# EAGLE design Board AWS_ESP32_v6 (EAGLE 9.5.2)
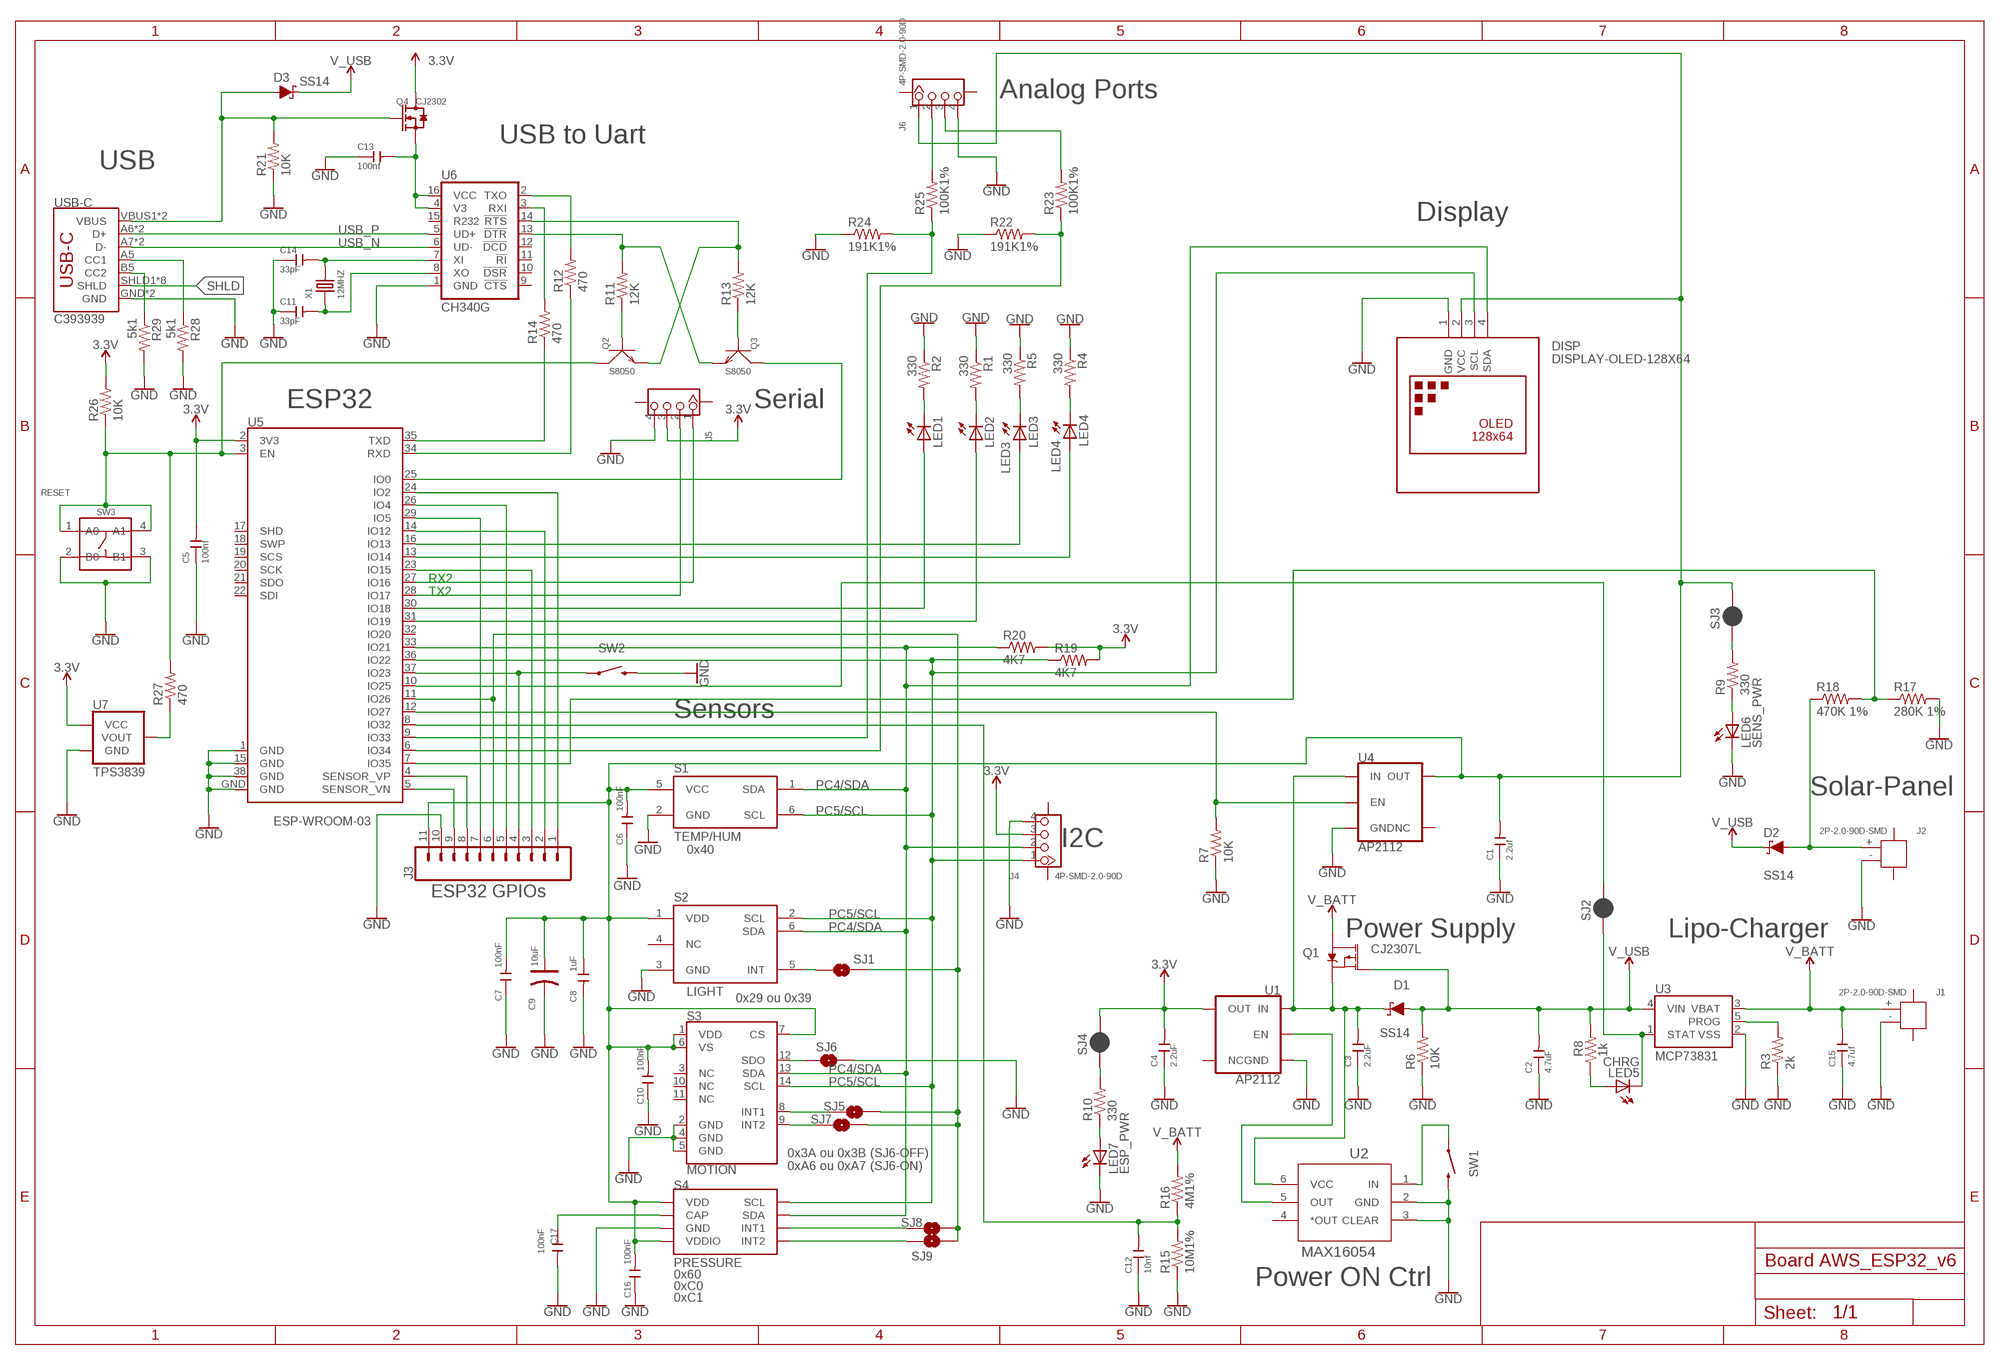
[diagram p0: schematic, sheet 1]

## Parts
C1  2.2uf  CERAMIC-2.2UF-10V-10%-X7R(0603)  [C0603]
C2  4.7uF  CERAMIC-4.7UF-10V-10%-X5R(0603)  [C0603]
C3  2.2uF  CERAMIC-2.2UF-10V-10%-X7R(0603)  [C0603]
C4  2.2uF  CERAMIC-2.2UF-10V-10%-X7R(0603)  [C0603]
C5  100nf  CERAMIC-100NF-50V-10%-X7R(0603)  [C0603]
C6  100nF  C-0603  [C0603]
C7  100nF  C-0603  [C0603]
C8  1uF  C-0805  [C0805]
C9  10uF  CAP-AVX-A  [AVX-A]
C10  100nF  C-0603  [C0603]
C11  33pF  CERAMIC-10PF-50V-5%-NPO(0603)  [C0603]
C12  10nf  CERAMIC-100NF-50V-10%-X7R(0603)  [C0603]
C13  100nf  CERAMIC-100NF-50V-10%-X7R(0603)  [C0603]
C14  33pF  CERAMIC-10PF-50V-5%-NPO(0603)  [C0603]
C15  4.7uf  CERAMIC-4.7UF-10V-10%-X5R(0603)  [C0603]
C16  100nF  C-0603  [C0603]
C17  100nF  C-0603  [C0603]
D1  SS14  DIODE-SCHOTTKY-SS14  [SMA-DIODE]
D2  SS14  DIODE-SCHOTTKY-SS14  [SMA-DIODE]
D3  SS14  DIODE-SCHOTTKY-SS14  [SMA-DIODE]
DISP  DISPLAY-OLED-128X64  DISPLAY-OLED-128X64-I2C  [DISPLAY-OLED-128X64-I2C]
J1  2P-2.0-90D-SMD  CONN-HEADER-SMD-PH-SIDE-(2P-2.0MM)  [HW2-SMD-2.0-90D]
J2  2P-2.0-90D-SMD  CONN-HEADER-SMD-PH-SIDE-(2P-2.0MM)  [HW2-SMD-2.0-90D]
J3  CONN_11  [1X11]
J4  4P-SMD-2.0-90D  GROVE-CONNECTOR-SMD-90D(4+2P-2.0)  [HW4-SMD-2.0-90D]
J5  4P-SMD-2.0-90D  GROVE-CONNECTOR-SMD-90D(4+2P-2.0)  [HW4-SMD-2.0-90D]
J6  4P-SMD-2.0-90D  GROVE-CONNECTOR-SMD-90D(4+2P-2.0)  [HW4-SMD-2.0-90D]
LED1  LED1  LED0603  [LED-0603]
LED2  LED2  LED0603  [LED-0603]
LED3  LED3  LED0603  [LED-0603]
LED4  LED4  LED0603  [LED-0603]
LED5  CHRG  LED0603  [LED-0603]
LED6  SENS_PWR  LED0603  [LED-0603]
LED7  ESP_PWR  LED0603  [LED-0603]
Q1  CJ2307L  MOSFET_PCH-DMG2307L  [SOT23-3]
Q2  S8050  SMD-TRANSISTORS-NPN-25V-500MW-S8050(SOT-23)  [SOT-23]
Q3  S8050  SMD-TRANSISTORS-NPN-25V-500MW-S8050(SOT-23)  [SOT-23]
Q4  CJ2302  SMD-MOSFET-N-CH-20V-2.1A-CJ2302(SOT-23)  [SOT-23]
R1  330  RESISTOR0805-RES  [0805]
R2  330  RESISTOR0805-RES  [0805]
R3  2k  RESISTOR0805-RES  [0805]
R4  330  RESISTOR0805-RES  [0805]
R5  330  RESISTOR0805-RES  [0805]
R6  10K  RESISTOR0805-RES  [0805]
R7  10K  RESISTOR0805-RES  [0805]
R8  1k  RESISTOR0805-RES  [0805]
R9  330  RESISTOR0805-RES  [0805]
R10  330  RESISTOR0805-RES  [0805]
R11  12K  RESISTOR0805-RES  [0805]
R12  470  RESISTOR0805-RES  [0805]
R13  12K  RESISTOR0805-RES  [0805]
R14  470  RESISTOR0805-RES  [0805]
R15  10M1%  RESISTOR0805-RES  [0805]
R16  4M1%  RESISTOR0805-RES  [0805]
R17  280K 1%  RESISTOR0805-RES  [0805]
R18  470K 1%  RESISTOR0805-RES  [0805]
R19  4K7  RESISTOR0805-RES  [0805]
R20  4K7  RESISTOR0805-RES  [0805]
R21  10K  RESISTOR0805-RES  [0805]
R22  191K1%  RESISTOR0805-RES  [0805]
R23  100K1%  RESISTOR0805-RES  [0805]
R24  191K1%  RESISTOR0805-RES  [0805]
R25  100K1%  RESISTOR0805-RES  [0805]
R26  10K  RESISTOR0805-RES  [0805]
R27  470  RESISTOR0805-RES  [0805]
R28  5k1  RESISTOR0805-RES  [0805]
R29  5k1  RESISTOR0805-RES  [0805]
S1  TEMP/HUM  HDC1080  [WSON6]
S2  LIGHT  TSL2571FN  [FN-6]
S3  MOTION  ADXL345  [LGA-14]
S4  PRESSURE  MPL3115A2LGA8  [LGA8]
SJ1  IRQ_LIGHT  SOLDERJUMPERNO  [SJ_2S-NO]
SJ2  JUMPER-SMT_2_NC_PASTE_SILK  [SMT-JUMPER_2_NC_PASTE_SILK]
SJ3  JUMPER-SMT_2_NC_PASTE_SILK  [SMT-JUMPER_2_NC_PASTE_SILK]
SJ4  JUMPER-SMT_2_NC_PASTE_SILK  [SMT-JUMPER_2_NC_PASTE_SILK]
SJ5  INT1  SOLDERJUMPERNO  [SJ_2S-NO]
SJ6  ADXL_ADDRESS  SOLDERJUMPERNO  [SJ_2S-NO]
SJ7  INT1  SOLDERJUMPERNO  [SJ_2S-NO]
SJ8  INT1  SOLDERJUMPERNO  [SJ_2S-NO]
SJ9  INT2  SOLDERJUMPERNO  [SJ_2S-NO]
SW1  MOMENTARY-SWITCH-SPST-SMD-6.0X3.5MM  [TACTILE_SWITCH_SMD_6.0X3.5MM]
SW2  MOMENTARY-SWITCH-SPST-SMD-6.0X3.5MM  [TACTILE_SWITCH_SMD_6.0X3.5MM]
SW3  RESET  SMD-SWITCH-TACTILE-SPST-NO(4P-D6.0MM)  [SW4-SMD-6.0X6.0X5.0MM]
U1  AP2112  V_REG_AP2112K-3.3V  [SOT23-5]
U2  MAX16054  [SOT23-6]
U3  MCP73831  [SOT23-5]
U4  AP2112  V_REG_AP2112K-3.3V  [SOT23-5]
U5  ESP-WROOM-03  [ESP-WROOM-03]
U6  CH340G  CH340GSMD  [SO016]
U7  TPS3839  V_SUPERVISOR  [SOT23-3]
USB-C  C393939  SPARKFUN-CONNECTORS_USB_C16PIN  [SPARKFUN-CONNECTORS_USB-C-16P]
X1  12MHZ  SMD-CRYSTAL-12MHZ-20PF-20PPM-40R(2P-5.0X3.2MM)  [X2-SMD-5.0X3.2X1.3MM]

## Nets
3.3V [power]: C4.2 C5.2 J4.3 J5.3 Q4.3(D) R19.2 R20.2 R26.2 SJ4.2 U1.5(OUT) U5.2(3V3) U7.3(VCC)
BEE_RESET: Q2.3(C) R26.1 R27.2 SW3.1(A0) SW3.4(A1) U5.3(EN)
GND [power]: C1.1 C2.1 C3.1 C4.1 C5.1 C6.1 C7.1 C8.2 C9.- C10.1 C11.1 C12.1 C13.1 C14.1 C15.1 C16.1 C17.2 DISP.1(GND) J1.- J2.- J3.10 J4.4 J5.4 J6.4 LED6.C LED7.C R1.1 R2.1 R3.1 R4.1 R5.1 R6.1 R7.1 R15.1 R17.2 R21.1 R22.1 R24.1 R28.2 R29.2 S1.2(GND) S2.3(GND) S3.2(GND) S3.4(GND) S3.5(GND) S4.3(GND) SJ6.2 SW1.2 SW2.2 SW3.2(B0) SW3.3(B1) U1.2(GND) U2.2(GND) U2.3(CLEAR) U3.2(VSS) U4.2(GND) U5.1(GND) U5.15(GND) U5.38(GND) U5.GND U6.1(GND) U7.1(GND) USB-C.GND USB-C.GND2(GND)
N$1 [power]: C1.2 C6.2 C7.2 C8.1 C9.+ C10.2 C16.2 DISP.2(VCC) J3.11 J6.1 S1.5(VCC) S2.1(VDD) S3.1(VDD) S3.6(VS) S3.7(CS) S4.1(VDD) S4.4(VDDIO) SJ3.2 U4.5(OUT)
N$2: LED3.A U5.16(IO13)
N$3 [power]: D2.A J2.+ R18.1
N$4: R27.1 U7.2(VOUT)
N$5: LED1.A U5.30(IO18)
N$6: J3.5 U5.26(IO4)
N$7: C17.1 S4.2(CAP)
N$8: S3.8(INT1) SJ5.1
N$9: S3.9(INT2) SJ7.1
N$10 [power]: C13.2 Q4.2(S) U6.4(V3) U6.16(VCC)
N$11: LED2.A U5.31(IO19)
N$12: C12.2 R15.2 R16.1 U5.8(IO32)
N$13: J3.4 SW2.1 U5.37(IO23)
N$14: SW1.1 U2.1(IN)
N$15: C14.2 U6.7(XI) X1.2
N$16: J5.1 U5.27(IO16)
N$17: J5.2 U5.28(IO17)
N$18 [power]: U1.3(EN) U2.5(OUT)
N$19: Q2.1(B) R11.1
N$20: C11.2 U6.8(XO) X1.1
N$21: S3.12(SDO) SJ6.1
N$22: R3.2 U3.5(PROG)
N$23 [power]: D3.A Q4.1(G) R21.2 USB-C.VBUS1(VBUS) USB-C.VBUS2(VBUS)
N$24: R29.1 USB-C.B5(CC2)
N$25: S4.6(INT1) SJ8.1
N$26: S4.5(INT2) SJ9.1
N$27: S2.5(INT) SJ1.1
N$28: R12.1 U5.34(RXD)
N$29: R14.1 U5.35(TXD)
N$30: Q3.1(B) R13.1
N$31: R28.1 USB-C.A5(CC1)
N$32: LED1.C R2.2
N$33: LED2.C R1.2
N$34: Q2.2(E) R13.2 U6.14(!RTS)
N$35: LED4.C R4.2
N$36: LED3.C R5.2
N$37: Q3.3(C) U5.25(IO0)
N$38: Q3.2(E) R11.2 U6.13(!DTR)
N$39: R24.2 R25.1 U5.9(IO33)
N$40: R22.2 R23.1 U5.6(IO34)
N$41: J6.2 R25.2
N$42: J6.3 R23.2
N$43: R17.1 R18.2 U5.7(IO35)
N$44: R14.2 U6.3(RXI)
N$45: R12.2 U6.2(TXO)
N$46: SJ2.2 U5.10(IO25)
N$47: J3.7 U5.29(IO5)
N$49: LED5.A R8.1
N$50 [power]: C3.2 D1.C Q1.2(S) U1.1(IN) U2.6(VCC) U4.1(IN)
N$51: LED7.A R10.1
N$52: R10.2 SJ4.1
N$53: LED5.C SJ2.1 U3.1(STAT)
N$54: LED4.A U5.13(IO14)
N$55: LED6.A R9.1
N$56: R7.2 U4.3(EN) U5.12(IO27)
N$58: R9.2 SJ3.1
N$64: J3.9 U5.5(SENSOR_VN)
N$65: J3.8 U5.4(SENSOR_VP)
N$72: J3.3 U5.23(IO15)
N$73: J3.2 U5.14(IO12)
N$74: J3.1 U5.24(IO2)
PC4/SDA: DISP.4(SDA) J4.2 R20.1 S1.1(SDA) S2.6(SDA) S3.13(SDA) S4.7(SDA) U5.33(IO21)
PC5/SCL: DISP.3(SCL) J4.1 R19.1 S1.6(SCL) S2.2(SCL) S3.14(SCL) S4.8(SCL) U5.36(IO22)
PD3/IRQ: J3.6 SJ1.2 SJ5.2 SJ7.2 SJ8.2 SJ9.2 U5.11(IO26)
SHLD: USB-C.SHLD1(SHLD) USB-C.SHLD2(SHLD) USB-C.SHLD3(SHLD) USB-C.SHLD4(SHLD) USB-C.SHLD5(SHLD) USB-C.SHLD6(SHLD) USB-C.SHLD7(SHLD) USB-C.SHLD8(SHLD)
USB_N [diff pairs]: U6.6(UD-) USB-C.A7(D-) USB-C.B7(D-)
USB_P [diff pairs]: U6.5(UD+) USB-C.A6(D+) USB-C.B6(D+)
V_BATT [power]: C15.2 J1.+ Q1.3(D) R16.2 U3.3(VBAT)
V_USB [power]: C2.2 D1.A D2.C D3.C Q1.1(G) R6.2 R8.2 U3.4(VIN)
Unconnected: J1.3 J1.4 J2.3 J2.4 J4.SS1 J4.SS2 J5.SS1 J5.SS2 J6.SS1 J6.SS2 S2.4(NC) S3.3(NC) S3.10(NC) S3.11(NC) U1.4(NC) U2.4(*OUT) U4.4(NC) U5.17(SHD) U5.18(SWP) U5.19(SCS) U5.20(SCK) U5.21(SDO) U5.22(SDI) U5.32(IO20) U6.9(!CTS) U6.10(!DSR) U6.11(!RI) U6.12(!DCD) U6.15(R232)

## Notes on the sheet
- Analog Ports
- USB to Uart
- USB
- Display
- ESP32 | Serial
- RX2
- TX2
- Sensors
- Solar-Panel
- I2C
- 0x40
- ESP32 GPIOs
- Power Supply | Lipo-Charger
- 0x29 ou 0x39
- 0x3A ou 0x3B (SJ6-OFF)
- 0xA6 ou 0xA7 (SJ6-ON)
- 0x60
- Power ON Ctrl
- 0xC0
- 0xC1

## Library data of the parts
C1 = OPL_Capacitor:CERAMIC-2.2UF-10V-10%-X7R(0603): 302010054; MPN: CC0603KRX7R6BB225
C2 = OPL_Capacitor:CERAMIC-4.7UF-10V-10%-X5R(0603): 302010111; MPN: CC0603KRX5R6BB475; VALUE: 4.7uf
C3 C4 = OPL_Capacitor:CERAMIC-2.2UF-10V-10%-X7R(0603): 302010054; MPN: CC0603KRX7R6BB225; VALUE: 2.2uf
C5 C13 = OPL_Capacitor:CERAMIC-100NF-50V-10%-X7R(0603): 302010138; MPN: CC0603KRX7R9BB104
C6-C8 C10 C16 C17 = Discrete:C*: Ceramic Capacitors
C9 = Discrete:CAP*: Electrolytic Capacitors,Tantalum Capacitors and Super Capacitors
C11 C14 = OPL_Capacitor:CERAMIC-10PF-50V-5%-NPO(0603): 302010097; MPN: CC0603JRNPO9BN100; VALUE: 10pf
C12 = OPL_Capacitor:CERAMIC-100NF-50V-10%-X7R(0603): 302010138; MPN: CC0603KRX7R9BB104; VALUE: 100nf
C15 = OPL_Capacitor:CERAMIC-4.7UF-10V-10%-X5R(0603): 302010111; MPN: CC0603KRX5R6BB475
D1-D3 = SparkFun-DiscreteSemi:DIODE-SCHOTTKY: Schottky diode A Schottky diode is a semiconductor diode which has a low forward voltage drop and a very fast switching action.; PROD_ID: DIO-08053; VALUE: 1A/40V/500mV
DISP = diy-modules:DISPLAY-OLED-128X64-I2C: 128x64 Dot Matrix OLED Module based on SSD1306 chip Variant with I2C interface More details available here: http://www.instructables.com/id/Monochrome-096-i2c-OLED-display-with-arduino-SSD13/ SSD1306 datasheet: https://cdn-shop.adafruit.com/datasheets/SSD1306.pdf Click here to find device on ebay.com <http://www.ebay.com/sch/oled+display+128x64+iic> Note: There are two variants: I2C and SPI. Search for the proper version.
J1 J2 = OPL_Connector:CONN-HEADER-SMD-PH-SIDE-(2P-2.0MM): 320110026
J3 = SparkFun-Connectors:CONN_11: Multi connection point. Often used as Generic Header-pin footprint for 0.1 inch spaced/style header connections On any of the 0.1 inch spaced packages, you can populate with these: Break Away Headers - Straight <https://www.sparkfun.com/products/116> (PRT-00116) Break Away Male Headers - Right Angle <https://www.sparkfun.com/products/553> (PRT-00553) Female Headers <https://www.sparkfun.com/products/115> (PRT-00115) Break Away Headers - Machine Pin <https://www.sparkfun.com/products/117> (PRT-00117) Break Away Female Headers - Swiss Machine Pin <https://www.sparkfun.com/products/743> (PRT-00743) For SCREWTERMINALS and SPRING TERMINALS visit here: Screw Terimnals on SparkFun.com <https://www.sparkfun.com/search/results?term=Screw+Terminals> (5mm/3.5mm/2.54mm spacing) This device is also useful as a general connection point to wire up your design to another part of your project. Our various solder wires solder well into these plated through hole pads. Hook-Up Wire - Assortment (Stranded, 22 AWG) <https://www.sparkfun.com/products/11375> (PRT-11375) Hook-Up Wire - Assortment (Solid Core, 22 AWG) <https://www.sparkfun.com/products/11367> (PRT-11367) View the entire wire category on our website here <https://www.sparkfun.com/categories/141>
J4-J6 = OPL_Connector:GROVE-CONNECTOR-SMD-90D(4+2P-2.0): 320110032
LED1-LED7 = FTDI Basic-v22-3.3V:LED: LEDs Standard schematic elements and footprints for 5mm, 3mm, 1206, and 0603 sized LEDs. 5mm - Spark Fun Electronics SKU : COM-00529 (and others)
Q1 = SparkFun-DiscreteSemi:MOSFET_PCH: P-channel MOSFETs Voltage controlled devices that allow control of high current outputs. SparkFun Products: SparkFun ESP32 Thing <https://www.sparkfun.com/products/13907> SparkFun ESP8266 Thing <https://www.sparkfun.com/products/13231>; PROD_ID: TRANS-11308; VALUE: 2.5A/30V/105mΩ
Q2 Q3 = OPL_Discrete_Semiconductor:SMD-TRANSISTORS-NPN-25V-500MW-S8050(SOT-23): 305010017; MPN: S8050
Q4 = OPL_Discrete_Semiconductor:SMD-MOSFET-N-CH-20V-2.1A-CJ2302(SOT-23): 305030015; MPN: CJ2302
R1-R24 R26-R29 = FTDI Basic-v22-3.3V:RESISTOR: Resistor Basic schematic elements and footprints for 0603, 1206, and PTH resistors.
R25 = FTDI Basic-v22-3.3V:RESISTOR: Resistor Basic schematic elements and footprints for 0603, 1206, and PTH resistors.; SPICEPREFIX: R
S1 = we-sensor:HDC1080: TI HDC1080 Humidity and Temperature Sensor
S2 = mike-temp:TSL2571: TSL2571 illumination sensor Approximates Human Eye Response Precisely Measures Illuminance Programmable Interrupt Function with User-Defined Upper and Lower Threshold 400 KHz I2C interface Programmable Analog Gain and Integration Time Supporting 1,000,000-to-1 Dynamic Range Automatically Rejects 50/60-Hz Lighting Ripple Low Active Power (0.75 mW Typical) with Power Down Mode RoHS Compliant The TSL2561 is a light-to-digital converter that transform light intensity to a digital signal output via I2C interface. The device combines one broadband photodiode (visible plus infrared) and one infrared-responding photodiode on a single CMOS integrated circuit capable of providing a near-photopic response over an effective 20-bit dynamic range (16-bit resolution). Two integrating ADCs convert the photodiode currents to a digital output that represents the irradiance measured on each channel. This digital output can be input to a microprocessor where illuminance (ambient light level) in lux is derived using an empirical formula to approximate the human eye response. The TSL2561 device supports a traditional level style interrupt that remains asserted until the firmware clears it.
S3 = SparkFun-Sensors:ADXL345: Analog Devices ADXL345 3-Axis SPI/I2C 2/4/8/16g Accelerometer The ADXL345 is a small, thin, low power, 3-axis accelerometer with high resolution (13-bit) measurement at up to ±16g. Digital output data is formatted as 16-bit twos complement and is accessible through either a SPI (3- or 4-wire) or I2C digital interface. Datasheet <https://www.sparkfun.com/datasheets/Sensors/Accelerometer/ADXL345.pdf> SparkFun Products SparkFun Triple Axis Accelerometer Breakout - ADXL345 <https://www.sparkfun.com/products/9836> (SEN-09836) Triple Axis Accelerometer - ADXL345 <https://www.sparkfun.com/products/9045> (SEN-09045) SparkFun 6 Degrees of Freedom IMU Digital Combo Board - ITG3200/ADXL345 <https://www.sparkfun.com/products/10121> (SEN-10121); PROD_ID: IC-09097; SF_ID: SEN-09045
S4 = SparkFun-Sensors:MPL3115A2: Altimeter/Pressure Sensor, I2C, 1.95V-3.6V supply, 50 to 110kPa; PROD_ID: IC-10869
SJ1 SJ5-SJ9 = JL-temp:SOLDERJUMPER: Solder Jumper Standard SMD solder jumper. Used to automate production. Two varients : Normally Open and Normally Closed are the same, but have different paste layers. NC will have a large amount of paste and should jumper during reflow.
SJ2-SJ4 = SparkFun-Jumpers:JUMPER-SMT_2_NC_PASTE: Normally closed solder jumper This jumper has an aperture in the stencil to allow solder paste to bridge the split in the wire so it's normally closed (NC). Wick off the solder to open the connection. Reapply solder to reclose the connection.
SW1 SW2 = SparkFun-Switches:MOMENTARY-SWITCH-SPST: Momentary Switch (Pushbutton) - SPST Normally-open (NO) SPST momentary switches (buttons, pushbuttons). Variants PTH-12MM - 12mm square, through-hole Momentary Pushbutton Switch - 12mm Square <https://www.sparkfun.com/products/9190> (COM-09190) PTH-6.0MM, PTH-6.0MM-KIT - 6.0mm square, through-hole Mini Pushbutton Switch <https://www.sparkfun.com/products/97> (COM-00097) KIT package intended for soldering kit's - only one side of pads' copper is exposed. PTH-RIGHT-ANGLE-KIT - Right-angle, through-hole Right Angle Tactile Button <https://www.sparkfun.com/products/10791> - Used on SparkFun BigTime Watch Kit <https://www.sparkfun.com/products/11734> SMD-12MM - 12mm square, surface-mount Tactile Button - SMD (12mm) <https://www.sparkfun.com/products/12993> (COM-12993) Used on SparkFun PicoBoard <https://www.sparkfun.com/products/11888> SMD-4.5MM - 4.5mm Square Trackball Switch Used on SparkFun Blackberry Trackballer Breakout <https://www.sparkfun.com/products/13169> SMD-4.6MMX2.8MM - 4.60mm x 2.80mm, surface mount Used on SparkFun SAMD21 Mini Breakout <https://www.sparkfun.com/products/13664> SMD-5.2MM, SMD-5.2-REDUNDANT - 5.2mm square, surface-mount Mini Pushbutton Switch - SMD <https://www.sparkfun.com/products/8720> (COM-08720) Used on Arduino Pro Mini <https://www.sparkfun.com/products/11114> REDUNDANT package connects both switch circuits together SMD-6.0X3.5MM - 6.0 x 3.5mm, surface mount Momentary Reset Switch SMD <https://www.sparkfun.com/products/8229> (COM-08229) SMD-6.2MM-TALL - 6.2mm square, surface mount Tactile Button - SMD (6mm) <https://www.sparkfun.com/products/12992> Used on SparkFun Digital Sandbox <https://www.sparkfun.com/products/12651> SMD-RIGHT-ANGLE - Right-angle, surface mount Used on SparkFun Block for Intel® Edison - Arduino <https://www.sparkfun.com/products/13036>; PROD_ID: SWCH-00815; SF_SKU: COM-08229
SW3 = OPL_Switch:SMD-SWITCH-TACTILE-SPST-NO(4P-D6.0MM): 311020004; MPN: DTSM-62K-S-V-T/R(SN431)
U1 U4 = SparkFun-IC-Power:V_REG_AP2112: AP2112 - 600mA CMOS LDO Regulator w/ Enable The AP2112 is CMOS process low dropout linear regulator with enable function, the regulator delivers a guaranteed 600mA (min.) continuous load current. Features Output Voltage Accuracy: ±1.5% Output Current: 600mA (Min.) Foldback Short Current Protection: 50mA Enable Function to Turn ON/OFF VOUT Low Dropout Voltage (3.3V): 250mV (Typ.) @IOUT=600mA Excellent Load Regulation: 0.2%/A (Typ.) Excellent Line Regulation: 0.02%/V (Typ.) Low Quiescent Current: 55μA (Typ.) Low Standby Current: 0.01μA (Typ.) Low Output Noise: 50μVRMS PSRR: 100Hz -65dB, 1kHz -65dB OTSD Protection Stable with 1.0μF Flexible Cap: Ceramic, Tantalum and Aluminum Electrolytic Operation Temperature Range: -40°C to 85°C ESD: MM 400V, HBM 4000V; PROD_ID: VREG-12457; VALUE: 3.3V
U2 = max16054:MAX16054: MAXIM Integrated power controller chip; MF: Maxim Integrated; MOUSER: 700-MAX16054AZTT; MPN: MAX16054AZT+T
U3 = SparkFun-IC-Power:MCP73831: MCP73831T Li-Ion, Li-Pol Controller Miniature single cell, fully integrated Li-Ion, Li-polymer charge management controller Datasheet <http://ww1.microchip.com/downloads/en/DeviceDoc/20001984g.pdf> SparkFun Products: SparkFun ESP32 Thing <https://www.sparkfun.com/products/13907> SparkFun 9DoF Razor IMU M0 <https://www.sparkfun.com/products/14001>; PROD_ID: IC-09995
U5 = esp32:ESP-WROOM-03
U6 = SparkFun-IC-Comms:CH340G: A simple USB 2.0 to Serial IC.; PROD_ID: IC-13498
U7 = SparkFun-IC-Power:V_SUPERVISOR: BD48xxx - Voltage Detector IC ROHM’s BD48xxx and BD49xxx series are highly accurate, low-current Voltage Detector IC series. The family includes BD48xxx devices with N-channel open drain output and BD49xxx devices with CMOS output. The devices are available for specific detection voltages ranging from 2.3V to 6.0V in increments of 0.1V.; PROD_ID: IC-14809
USB-C = Serial-Basic-CH340C-and-USBC:SPARKFUN-CONNECTORS_USB_C: USB Type C 16Pin Connector Super Speed pins not available on the 16-pin purely SMD connector so this part is best for USB 2.0 implementations. D1 and D2 are tied together enabling D+/- no matter which way the cable is plugged into the connector. The two channel configuration pins (CC1/2) are exposed. These are normally connected to ground via 5.1k resistors but can be reconfigured for high current/high power applications.; PROD_ID: CONN-14122
X1 = OPL_Crystal Oscillator:SMD-CRYSTAL-12MHZ-20PF-20PPM-40R(2P-5.0X3.2MM): 306010047; MPN: 5032/2P

## Net classes
0 default: width 0.254 mm, clearance 0.127 mm
1 power: width 0.508 mm, clearance 0.127 mm
2 sensor: width 0.381 mm, clearance 0.127 mm
3 diff pairs: width 0.127 mm

## Board
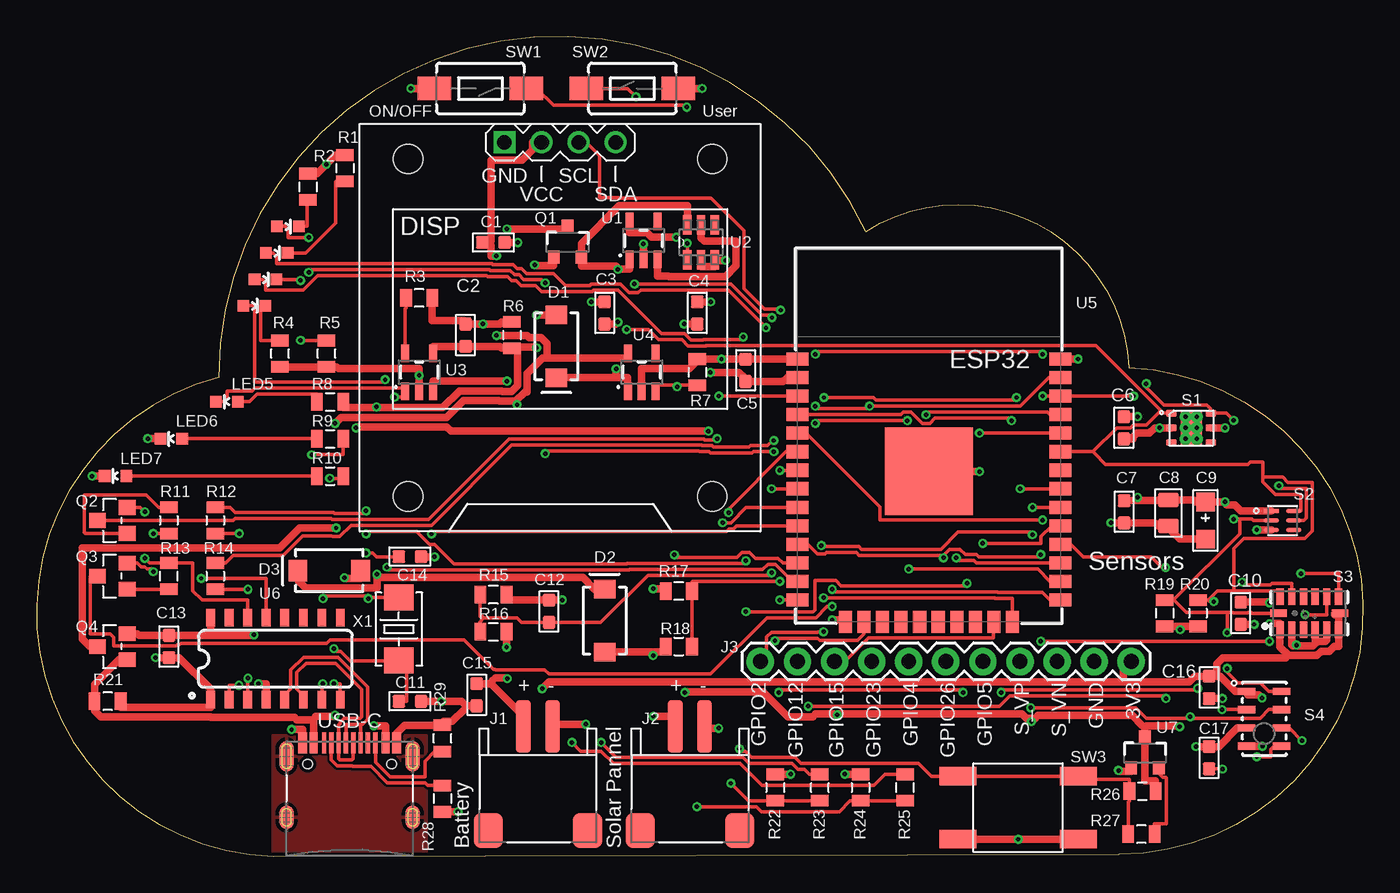
[diagram p1: board, top side]
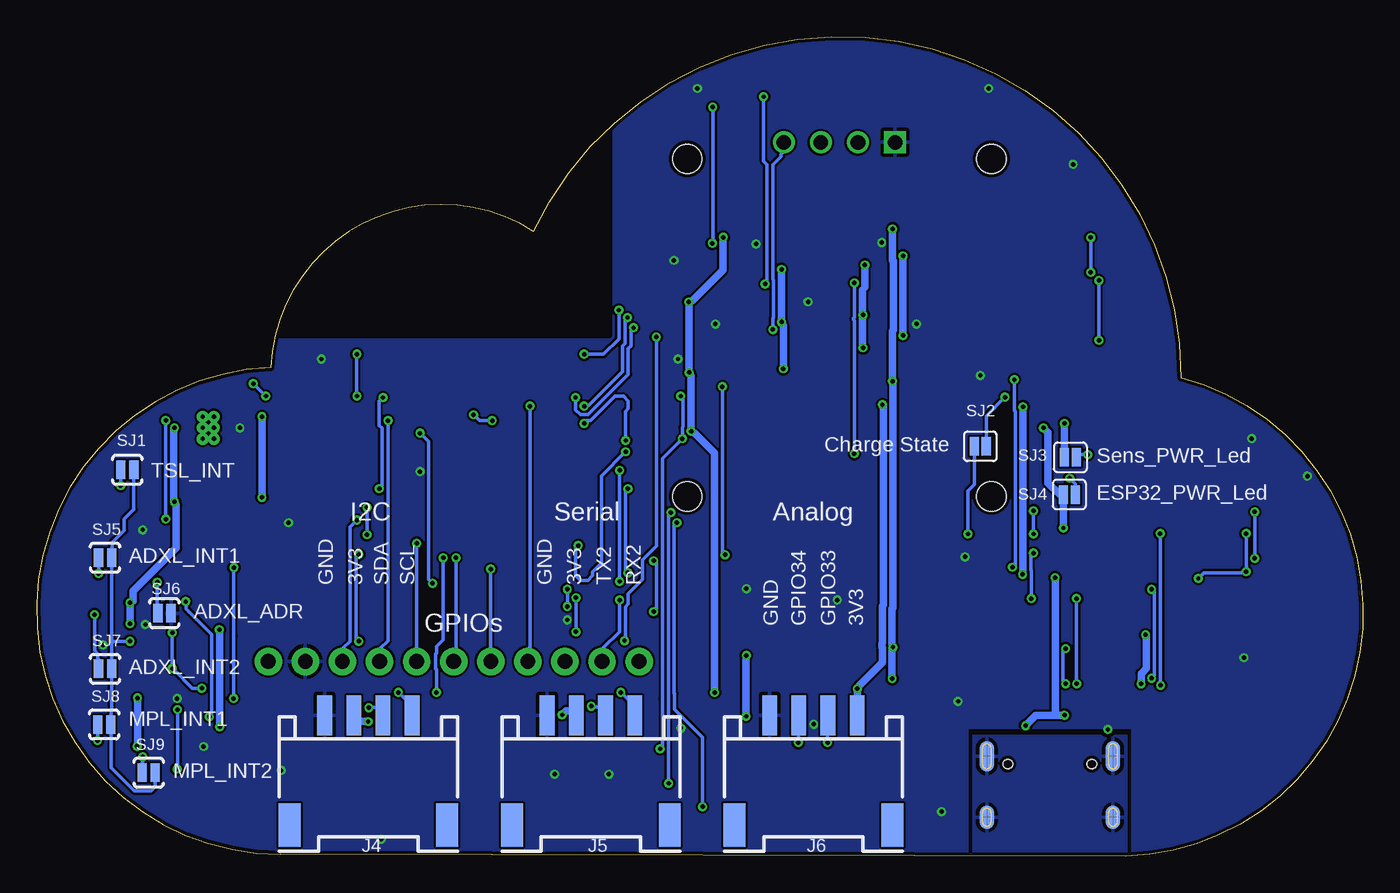
[diagram p2: board, bottom side, seen from below]

Size 90.84 x 56.14 mm. Coordinates in mm from the lower left corner, seen from the top.
Outline: 16.23,0 74.14,0.13 arc178 74.81,33.46 arc120 56.81,42.79 arc155 12.47,32.79 arc164 16.23,0
Copper layers (1*16): Top 0.035mm / dielectric 1.5mm / Bottom 0.035mm
Design rules "SeeedStudio_2layer_DRU_no_angle_20140221": minimum track width 6mil, minimum drill 12mil, track to track 6mil, track to pad 6mil, pad to pad 6mil, via to via 6mil, smd to smd 0mil, copper to edge 10mil, drill to drill 10mil, minimum pad ring 10mil, minimum via ring 6mil, stop-mask expansion 2mil, vias tented up to drill 100mil, thermal gap 10mil
tRestrict: area 51.6,35.7 to 74.5,49.7
bRestrict: area 51.6,35.7 to 74.5,49.7

### Footprints (pad centres in the part's own frame; a part is rotated, then mirrored left to right if it is on the bottom)
C0603 = smd 0.889 x 0.889: 1 0,0.762; 2 0,-0.762
C0603' = smd 0.889 x 0.889: 1 -0.762,0; 2 0.762,0
C0805 = smd 1.016 x 1.397: 1 -0.889,0; 2 0.889,0
AVX-A = smd 1.27 x 1.27: + -1.27,0; - 1.27,0
SMA-DIODE = smd 1.27 x 1.47: A -2.15,0; C 2.15,0
DISPLAY-OLED-128X64-I2C = drill 1 square: 1 -3.81,12.7 | drill 1: 2 -1.27,12.7; 3 1.27,12.7; 4 3.81,12.7 | hole 2: -10.414,11.557; 10.414,11.557; 10.414,-11.557; -10.414,-11.557
HW2-SMD-2.0-90D = smd 2 x 2.4: 3 3.4,-2.181; 4 -3.4,-2.181 | smd 1 x 3.6: + -1,4.953; - 1,4.953
1X11 = drill 1.016 pad 1.88: 1 0,0; 2 2.54,0; 3 5.08,0; 4 7.62,0; 5 10.16,0; 6 12.7,0; 7 15.24,0; 8 17.78,0; 9 20.32,0; 10 22.86,0; 11 25.4,0
HW4-SMD-2.0-90D = smd 1.01 x 2.74: 1 -3,-0.1; 2 -1,-0.1; 3 1,-0.1; 4 3,-0.1 | smd 1.5 x 3: SS1 -5.4,7.4; SS2 5.4,7.4
LED-0603 = smd 0.8 x 0.8: A 0,-0.75; C 0,0.75
SOT23-3 = smd 0.8 x 0.9: 1 -0.95,-1; 2 0.95,-1; 3 0,1.1
SOT-23 = smd 1.016 x 1.143: 1 -0.889,-1.016; 2 0.889,-1.016; 3 0,1.016
0805 = smd 0.8 x 1.2: 1 -0.9,0; 2 0.9,0
WSON6 = smd 0.7 x 0.45: 1 -1.35,1; 2 -1.35,0; 3 -1.35,-1; 4 1.35,-1; 5 1.35,0; 6 1.35,1 | drill 0.3 pad 0.7: P$2 -0.381,0.762; P$3 0.381,0.762; P$4 -0.381,0; P$5 -0.381,-0.762; P$7 0.381,-0.762 | drill 0.3 pad 0.61: P$6 0.381,0 | smd 1.5 x 2.4: TP 0,0
FN-6 = smd 1.05 x 0.3: 1 -0.775,0.65; 2 -0.775,0; 3 -0.775,-0.65; 4 0.775,-0.65; 5 0.775,0; 6 0.775,0.65
LGA-14 = smd 0.5 x 1.124: 1 2,1.138; 2 1.2,1.138; 3 0.4,1.138; 4 -0.4,1.138; 5 -1.2,1.138; 6 -2,1.138; 8 -2,-1.13; 9 -1.2,-1.138; 10 -0.4,-1.138; 11 0.4,-1.138; 12 1.2,-1.138; 13 2,-1.138 | smd 1.124 x 0.5: 7 -2.1,0; 14 2.1,0
LGA8 = smd 1.2 x 0.5: 1 -1.2,1.875; 2 -1.2,0.625; 3 -1.2,-0.625; 4 -1.2,-1.875; 5 1.2,-1.875; 6 1.2,-0.625; 7 1.2,0.625; 8 1.2,1.875
SJ_2S-NO = smd 0.635 x 1.27: 1 -0.45,0; 2 0.45,0
SMT-JUMPER_2_NC_PASTE_SILK = smd 0.635 x 1.27: 1 -0.406,0; 2 0.406,0
TACTILE_SWITCH_SMD_6.0X3.5MM = smd 2.3 x 1.6: 1 -3.15,0; 2 3.15,0
SW4-SMD-6.0X6.0X5.0MM = smd 2.54 x 1.27: 1 -4.129,2.159; 2 -4.129,-2.159; 3 4.129,-2.159; 4 4.129,2.159
SOT23-5 = smd 0.55 x 1.2: 1 -0.95,-1.3; 2 0,-1.3; 3 0.95,-1.3; 4 0.95,1.3; 5 -0.95,1.3
SOT23-6 = smd 1.321 x 0.559: 1 -1.194,0.94; 2 -1.194,0; 3 -1.194,-0.94; 4 1.194,-0.94; 5 1.194,0; 6 1.194,0.94
ESP-WROOM-03 = smd 0.9 x 1.5: 1 7.7,9; 2 6.43,9; 3 5.16,9; 4 3.89,9; 5 2.62,9; 6 1.35,9; 7 0.08,9; 8 -1.19,9; 9 -2.46,9; 10 -3.73,9; 11 -5,9; 12 -6.27,9; 13 -7.54,9; 14 -8.81,9; 25 -8.81,-9; 26 -7.54,-9; 27 -6.27,-9; 28 -5,-9; 29 -3.73,-9; 30 -2.46,-9; 31 -1.19,-9; 32 0.08,-9; 33 1.35,-9; 34 2.62,-9; 35 3.89,-9; 36 5.16,-9; 37 6.43,-9; 38 7.7,-9 | smd 1.5 x 0.9: 15 -10.3,5.715; 16 -10.3,4.445; 17 -10.3,3.175; 18 -10.3,1.905; 19 -10.3,0.635; 20 -10.3,-0.635; 21 -10.3,-1.905; 22 -10.3,-3.175; 23 -10.3,-4.445; 24 -10.3,-5.715 | smd 6 x 6: GND 0,0
SO016 = smd 0.6 x 1.2: 1 -4.445,-2.8; 2 -3.175,-2.8; 3 -1.905,-2.8; 4 -0.635,-2.8; 5 0.635,-2.8; 6 1.905,-2.8; 7 3.175,-2.8; 8 4.445,-2.8; 9 4.445,2.8; 10 3.175,2.8; 11 1.905,2.8; 12 0.635,2.8; 13 -0.635,2.8; 14 -1.905,2.8; 15 -3.175,2.8; 16 -4.445,2.8
SPARKFUN-CONNECTORS_USB-C-16P = smd 0.3 x 1.45: A5 -1.25,0; A6 -0.25,0; A7 0.25,0; A8 1.25,0; B5 1.75,0; B6 0.75,0; B7 -0.75,0; B8 -1.75,0 | smd 0.6 x 1.45: GND -3.225,0; GND2 3.225,0 | smd 1 x 2.1: SHLD1 -4.32,-0.915; SHLD2 4.32,-0.915 | smd 1 x 2.1 bottom: SHLD3 -4.32,-0.915; SHLD4 4.32,-0.915 | smd 1 x 1.6: SHLD5 -4.32,-5.095; SHLD8 4.32,-5.095 | smd 1 x 1.6 bottom: SHLD6 -4.32,-5.095; SHLD7 4.32,-5.095 | smd 0.55 x 1.45: VBUS1 -2.45,0; VBUS2 2.45,0 | hole 0.65: -2.89,-1.445; 2.89,-1.445
X2-SMD-5.0X3.2X1.3MM = smd 1.778 x 2.032: 1 -2.159,0; 2 2.159,0

### Placement (x,y rotation side)
C1  31.29,42.04 270 top
C2  29.38,35.69 0 top
C3  38.91,37.21 0 top
C4  45.26,37.21 180 top
C5  48.56,33.27 0 top
C6  100nF  [C0603']  74.47,29.34 90 top
C7  100nF  [C0603']  74.49,23.58 90 top
C8  77.52,23.49 270 top
C9  80.06,22.99 270 top
C10  100nF  [C0603']  82.47,16.64 90 top
C11  25.57,10.6 270 top
C12  35.1,16.76 0 top
C13  9.06,14.35 180 top
C14  25.57,20.51 270 top
C15  30.14,11.05 180 top
C16  100nF  [C0603']  80.31,11.56 90 top
C17  100nF  [C0603']  80.31,6.73 90 top
D1  35.61,34.93 270 top
D2  38.91,16.13 90 top
D3  20.05,19.56 180 top
DISP  35.86,36.2 0 top
J1  34.34,3.94 0 top
J2  44.75,3.94 0 top
J3  49.58,13.34 0 top
J4  68.12,9.53 180 bottom
J5  52.88,9.53 180 bottom
J6  37.64,9.53 180 bottom
LED1  17.21,43.13 270 top
LED2  16.45,41.32 270 top
LED3  15.69,39.51 270 top
LED4  14.93,37.7 270 top
LED5  13.04,31.12 90 top
LED6  9.23,28.58 90 top
LED7  5.42,26.04 90 top
Q1  36.37,42.04 0 top
Q2  5.19,22.99 90 top
Q3  5.19,19.18 90 top
Q4  5.19,14.35 90 top
R1  21.13,47.12 270 top
R2  18.59,45.85 270 top
R3  26.21,38.23 180 top
R4  16.68,34.42 90 top
R5  19.86,34.42 90 top
R6  32.56,35.69 270 top
R7  45.26,33.15 270 top
R8  20.11,31.11 0 top
R9  20.11,28.57 0 top
R10  20.11,26.04 0 top
R11  9.06,22.99 270 top
R12  12.24,22.99 270 top
R13  9.06,19.18 90 top
R14  12.24,19.18 270 top
R15  31.29,17.91 180 top
R16  31.29,15.37 0 top
R17  43.99,18.16 180 top
R18  43.99,14.35 0 top
R19  77.26,16.64 270 top
R20  79.55,16.64 270 top
R21  4.87,10.6 180 top
R22  50.59,4.7 270 top
R23  53.64,4.7 90 top
R24  56.43,4.7 270 top
R25  59.48,4.7 90 top
R26  75.74,4.44 0 top
R27  75.67,1.5 180 top
R28  27.79,3.94 270 top
R29  27.79,8.06 90 top
S1  79.08,29.34 0 top
S2  85.34,22.99 0 top
S3  87.17,16.64 180 top
S4  84.08,9.41 0 top
SJ1  84.63,26.46 0 bottom
SJ2  26.21,28.07 180 bottom
SJ3  20.04,27.3 180 bottom
SJ4  20.11,24.77 180 bottom
SJ5  86.15,20.45 0 bottom
SJ6  82.09,16.64 0 bottom
SJ7  86.15,12.83 0 bottom
SJ8  86.21,9.02 0 bottom
SJ9  83.16,5.71 0 bottom
SW1  30.4,52.58 180 top
SW2  40.81,52.58 0 top
SW3  67.22,3.32 0 top
U1  41.57,42.16 0 top
U2  45.51,42.04 90 top
U3  26.21,33.15 0 top
U4  41.45,33.15 0 top
U5  61.12,26.35 90 top
U6  16.36,13.53 0 top
U7  75.91,7.06 0 top
USB-C  21.44,7.75 0 top
X1  24.81,15.56 90 top

### Tracks (layer width: path | path; a pad name or v marks a point on that pad's centre or on a via)
3.3V  (via drill 0.3)
  Top 0.508: 78.32,15.74 79.53,15.74 R20.2 | 78.32,15.74 77.27,15.74 R19.2 | R26.2 76.63,5.12 76.61,5.14 75.92,5.14 75.92,8.14 U7.3 75.92,8.42 75.92,8.83 | v78.3,8.86 78.25,8.91 75.99,8.91 75.92,8.83 | v78.32,15.51 78.32,15.74 | 68.14,9.45 68.39,9.45 68.57,9.62 75.05,9.62 75.71,8.96 75.92,8.83 | 68.14,9.45 67.78,9.45 67.5,9.73 54.9,9.73 v54.85,9.68 54.62,9.73 53.34,9.73 53.16,9.55 51.47,9.55 49.75,11.26 44.46,11.26 v44.4,11.21 | v68.14,9.21 68.14,9.45 | U5.2 52.11,32.79 51.42,32.79 51.14,32.51 48.58,32.51 C5.2 48.47,32.77 48.12,33.12 v46.15,33.12 | v46.17,37.96 45.27,37.96 C4.2 | v43.82,42.39 42.13,42.39 41.82,42.7 40.62,42.7 40.62,43.44 U1.5 | v20.52,22.48 18.01,22.48 16.65,21.12 3.14,21.12 3.14,14.87 3.65,14.36 4.16,14.36 Q4.3 | v46.02,29.11 28.38,29.11 28.1,29.39 21.93,29.39 v21.88,29.34
  Bottom 0.508: v78.32,15.51 78.3,15.49 v78.3,8.86 | v54.85,9.68 54.57,9.96 53.88,9.96 53.88,9.65 J5.3 | v68.14,9.21 69.11,9.21 J4.3 | v43.82,42.39 43.84,42.37 43.84,40.14 45.91,38.07 v46.17,37.96 46.15,37.94 v46.15,33.12 46.02,32.9 v46.02,29.11 45.79,28.98 44.4,27.6 v44.4,11.21 | v20.52,22.48 20.52,24.75 SJ4.2 20.78,24.75 21.57,25.55 21.57,29.03 v21.88,29.34
BEE_RESET  (via drill 0.3)
  Top 0.254: R27.2 74.77,1.51 74.77,3.71 74.82,3.71 74.84,3.74 74.84,4.43 R26.1 74.84,4.56 74.84,5.27 72.26,5.27 72.05,5.48 71.36,5.48 SW3.4 71.23,5.48 63.12,5.48 SW3.1 62.99,5.48 61.27,5.48 60.4,6.35 52.34,6.35 51.93,6.76 48.96,6.76 48.55,7.17 48.32,7.17 v48.14,7.35 | v46.61,28.59 46.53,28.52 45.76,28.52 45.71,28.57 32.37,28.57 26.87,23.06 20.24,23.06 20.19,23.12 13.61,23.12 13.48,22.99 Q2.3 | v46.73,31.51 U5.3
  Bottom 0.254: v46.73,31.51 46.55,31.33 46.55,29.41 46.61,29.36 v46.61,28.59 46.71,28.52 47.99,27.24 47.99,10.8 47.96,10.78 47.96,7.52 v48.14,7.35
GND  (via drill 0.3)
  Top 0.508: U4.2 41.43,31.87 41.43,33.38 44.71,33.38 45.15,33.82 R7.1 v46.91,34.05 C5.1 48.81,34.05 U5.1 | SW3.2 63.12,1.15 v67.24,1.15 71.34,1.15 SW3.3 | U3.2 26.2,31.87 v26.2,32.92 26.2,33.38 20.7,33.38 20.57,33.51 19.88,33.51 R5.1 19.6,33.51 16.71,33.51 R4.1 | R21.1 5.77,10.19 11.92,10.19 11.92,10.47 11.89,10.47 U6.1 11.92,10.75 11.92,11.44 9.77,13.59 C13.1 8.82,13.59 v8.15,13.59 | 29.43,10.29 29.12,10.6 v27.74,10.6 26.36,10.6 C11.1 | 29.43,10.29 30.12,10.29 C15.1 | USB-C.GND2 24.67,8.42 25.2,8.96 R29.2 27.89,9.21 28.46,9.21 29.3,10.06 29.43,10.29 | R6.1 31.86,36.58 31.73,36.45 v30.58,36.45 29.4,36.45 C2.1 29.27,36.68 27.1,36.68 R3.1 | C9.- 80.04,21.71 78.3,21.71 77.63,22.37 C8.2 77.51,22.6 76.81,22.6 76.58,22.83 74.51,22.83 C7.1 74.25,22.83 v73.59,22.83 | R2.1 18.6,46.75 19.21,46.75 v19.85,47.39 20.49,48.03 21.11,48.03 R1.1 | S4.3 82.86,8.78 82.24,8.78 80.96,7.5 80.32,7.5 C17.2 80.07,7.5 v79.4,7.5 | R15.1 32.19,17.89 32.19,17.54 35.09,17.54 C12.1 35.34,17.54 v36.01,17.54 | S1.2 77.71,29.34 v76.92,29.34 76.58,29.34 76.23,28.98 75.35,28.98 75.1,28.72 75.1,28.57 74.48,28.57 C6.1 | 86.29,14.41 87.41,14.41 87.57,14.57 | 86.29,14.41 86.03,14.41 85.98,14.46 85.98,15.49 S3.2 | 87.57,14.57 S3.4 | S3.5 88.36,14.8 88.26,14.69 87.8,14.69 87.57,14.57 | U2.2 45.51,40.83 45.51,40.37 46.45,40.37 46.45,40.83 U2.3 46.71,40.8 v47.19,40.8 | v3.8,26.03 4.65,26.03 LED7.C | v7.62,28.59 8.46,28.59 LED6.C | v27.25,20.5 26.36,20.5 C14.1 | v32.96,42.03 32.07,42.03 C1.1 | v38,37.96 38.9,37.96 C3.1 | v44.35,36.45 C4.1 | v81.22,10.8 80.32,10.8 C16.1 | v83.39,15.87 C10.1 | v74.1,5.86 74.15,5.81 74.97,5.81 74.97,6.04 U7.1
  Top 0.508: v83.57,22.35 84.55,22.35 S2.3 | v28.87,3.04 27.82,3.04 R28.2 | v51.65,5.6 50.6,5.6 R22.1 | v42.23,18.3 43.1,18.3 43.1,18.17 R17.2 | v55.36,5.6 56.41,5.6 R24.1 | v41.56,41.93 41.56,40.88 U1.2 | v17.47,8.68 18.22,8.68 USB-C.GND | v54.49,16.18 55.41,16.18 55.41,16.05 U5.15 | v71.34,34.05 70.13,34.05 U5.38 | v86.29,14.46 86.29,14.41 | v25.64,52.58 27.23,52.58 SW1.2 | v45.58,52.58 SW2.2 | v37.62,9.04 35.34,9.04 35.34,8.91 J1.- | v46.71,8.75 45.76,8.75 45.76,8.88 J2.- | v64.58,26.34 U5.GND
  Bottom 0.508: v17.47,8.68 17.47,8.76
  pour Bottom (rank 2): -2.11,0.13 15.79,0.13 15.79,8.76 27.1,8.76 27.1,0.13 92.37,0.13 92.5,0.25 92.5,56.52 -2.11,56.52
N$1  (via drill 0.3)
  Top 0.508: 31.04,42.03 C1.2 | 31.04,42.03 31.14,42.14 31.14,47.67 33.24,47.67 33.96,48.38 33.96,48.9 DISP.2 | 34.96,34.1 34.65,34.1 33.6,33.05 33.6,31.79 33.45,31.79 32.81,31.15 | 34.96,34.1 40.49,34.1 40.49,34.43 U4.5 | 32.81,31.15 31.71,31.15 31.66,31.2 29.25,31.2 28.1,30.05 20.85,30.05 v20.44,29.64 | v31.5,41.11 31.14,41.11 31.14,41.8 31.04,42.03 | v31.5,35.66 33.6,35.66 33.73,35.53 34.55,35.53 34.96,35.12 34.96,34.1 | 75.41,24.34 76.76,24.34 76.81,24.4 77.51,24.4 C8.1 77.76,24.4 79.22,24.4 79.35,24.27 79.81,24.27 C9.+ v81.4,24.27 81.52,24.04 82.06,24.04 82.47,23.63 84.55,23.63 S2.1 | 75.41,24.34 74.51,24.34 C7.2 | v75.41,30.11 74.48,30.11 C6.2 | v75.41,24.57 75.41,24.34 | v81.4,29.34 80.45,29.34 S1.5 | v84.44,17.36 84.39,17.41 C10.2 | v84.44,15.92 85.16,15.92 85.16,15.51 S3.1 85.16,15.26 85.16,14.34 85.75,13.75 | 85.75,13.75 87.69,13.75 87.98,14.03 88.54,14.03 88.87,14.36 89.18,14.36 S3.6 89.18,15.74 89.18,16.41 89.05,16.54 88.9,16.54 88.9,16.64 89.26,16.64 S3.7 | 80.83,12.31 81.06,12.31 82.09,11.29 82.86,11.29 S4.1 82.96,11.03 83.73,11.03 v83.93,10.83 | 80.83,12.31 80.32,12.31 C16.2 80.07,12.31 79.32,12.31 78.94,11.93 74.43,11.93 | v83.96,7.52 82.88,7.52 S4.4 | v34.63,11.47 35.09,11.93 74.43,11.93 | 74.43,11.93 74.43,13.31 74.46,13.34 J3.11 | 80.83,12.31 80.83,13.16 81.24,13.57 85.57,13.57 85.75,13.75 | v32.91,30.92 32.81,31.15
  Bottom 0.508: v20.44,29.64 SJ3.2 | v31.5,35.66 v31.5,41.11 | v75.41,24.57 v75.41,30.11 | v81.4,29.34 81.45,29.29 81.45,24.32 v81.4,24.27 81.27,24.04 81.27,21.09 84.21,18.15 84.21,17.48 v84.44,17.36 v84.44,15.92 | v83.96,7.52 83.93,7.55 v83.93,10.83 | J6.1 34.63,9.65 v34.63,11.47 34.5,11.7 32.91,13.29 32.91,14.26 32.94,14.28 32.94,14.57 32.91,14.59 32.91,17.15 32.86,17.2 32.86,30.87 v32.91,30.92
N$2  (via drill 0.3)
  Top 0.254: v48.4,35.56 48.22,35.38 45.68,35.38 45.66,35.35 44.81,35.35 44.38,35.79 42.79,35.79 39.82,38.76 38.16,38.76 38.08,38.68 34.57,38.68 34.16,39.09 33.19,39.09 32.86,39.42 32.55,39.42 32.27,39.71 30.89,39.71 30.84,39.76 19.27,39.76 18.27,38.76 15.71,38.76 15.71,39.27 15.48,39.5 14.96,39.5 LED3.A | v50.57,14.75 50.75,14.92 53.49,14.92 53.65,14.77 56.21,14.77 56.67,15.23 56.67,16.02 U5.16
  Bottom 0.254: v48.4,35.56 48.4,21.25 49.35,20.3 49.35,18.94 50.32,17.97 50.32,17.28 50.52,17.07 50.52,14.8 v50.57,14.75
N$3  (via drill 0.3)
  Top 0.508: 42.23,13.98 38.93,13.98 D2.A | 42.23,13.98 43.1,13.98 43.1,14.34 R18.1 | v42.25,9.57 43.71,9.57 43.74,9.55 43.74,8.91 J2.+ | v42.23,13.75 42.23,13.98
  Bottom 0.508: v42.23,13.75 42.25,13.72 v42.25,9.57
N$4
  Top 0.254: U7.2 76.87,6.04 76.87,5.66 77.12,5.4 77.35,5.4 77.38,5.38 77.38,2.23 76.58,2.23 76.56,2.2 76.56,1.51 R27.1
N$5  (via drill 0.3)
  Top 0.254: v18.65,42.37 17.22,42.37 17.22,42.91 16.99,43.14 LED1.A | v18.65,39.99 18.83,40.16 31.02,40.16 31.07,40.11 32.45,40.11 32.73,39.83 33.04,39.83 33.37,39.5 34.6,39.5 v34.83,39.27 | v34.83,27.57 35.01,27.75 45.35,27.75 45.4,27.7 46.07,27.7 46.17,27.6 48.99,27.6 49.09,27.7 v50.5,27.7 | v53.75,21.27 53.83,21.2 56.33,21.2 56.51,21.02 61.94,21.02 63.12,22.19 68.03,22.19 v68.21,22.02 | v68.21,23.88 U5.30
  Bottom 0.254: v18.65,39.99 v18.65,42.37 | v34.83,39.27 34.83,36.89 34.88,36.84 34.88,36.73 34.83,36.68 v34.83,27.57 | v50.5,27.7 52.16,26.03 52.16,20.07 52.75,19.48 52.75,19.22 53.08,18.89 53.59,18.89 53.93,19.22 53.93,21.09 v53.75,21.27 | v68.21,23.88 v68.21,22.02
N$6  (via drill 0.3)
  Top 0.254: v59.74,19.66 68.57,19.66 69.42,18.81 U5.26
  Bottom 0.254: v59.74,19.66 J3.5
N$7  (via drill 0.3)
  Top 0.254: v81.22,5.96 80.32,5.96 C17.1 | v81.19,10.03 82.86,10.03 S4.2
  Bottom 0.254: v81.22,5.96 81.19,5.99 v81.19,10.03
N$8  (via drill 0.3)
  Top 0.254: v86.59,19.35 89.18,19.35 89.18,17.79 S3.8
  Bottom 0.254: v86.59,19.35 86.59,20.43 SJ5.1
N$9  (via drill 0.3)
  Top 0.254: v86.87,16.54 88.36,16.54 88.36,17.77 S3.9
  Bottom 0.254: v86.87,16.54 86.87,14.08 86.64,13.85 86.64,13.54 86.59,13.49 86.59,12.85 SJ7.1
N$10  (via drill 0.3)
  Top 0.508: Q4.2 6.9,15.23 7.03,15.1 9.05,15.1 C13.2 9.31,15.1 11.92,15.1 | v15.19,11.8 15.73,11.8 15.73,10.75 U6.4 | v14.89,15.15 14.84,15.1 11.92,15.1 | 11.92,15.1 11.92,16.31 U6.16
  Bottom 0.508: v15.19,11.8 15.19,12.49 14.84,12.85 14.84,15.1 v14.89,15.15
N$11  (via drill 0.3)
  Top 0.254: v49.96,36.2 47.4,38.76 42.89,38.76 42.87,38.78 41.38,38.78 41.2,38.6 40.56,38.6 40,39.17 37.98,39.17 37.9,39.09 36.24,39.09 35.42,39.91 33.55,39.91 33.22,40.24 32.91,40.24 32.63,40.52 31.25,40.52 31.19,40.58 16.45,40.58 16.45,41.09 16.22,41.32 LED2.A | v53.93,31.41 57.31,31.41 57.49,31.23 66.93,31.23 v67.11,31.41 | v67.37,25.16 U5.31
  Bottom 0.254: v49.96,36.2 50.14,36.02 50.14,34.94 50.32,34.76 50.32,33 53.08,30.23 53.59,30.23 53.93,30.56 v53.93,31.41 | v67.11,31.41 67.37,31.15 67.37,29.49 67.19,29.31 67.19,25.34 v67.37,25.16
N$12  (via drill 0.3)
  Top 0.254: 30.63,16.31 32.91,16.31 33.22,16 35.09,16 C12.2 35.21,16 38.64,16 41.87,19.22 50.16,19.22 v50.34,19.4 | 30.63,16.31 30.38,16.05 30.38,15.38 R16.1 | R15.2 30.38,17.89 30.38,16.41 30.55,16.41 30.63,16.31 | v50.34,25.16 U5.8
  Bottom 0.254: v50.34,25.16 50.52,24.98 50.52,19.58 v50.34,19.4
N$13  (via drill 0.3)
  Top 0.254: U5.37 70.11,32.79 69.34,32.79 67.37,30.82 v57.05,30.82 56.97,30.72 56.9,30.64 53.52,30.64 v53.34,30.82 | v41.05,52.02 40.49,52.58 SW2.1 | v40.95,39.19 43.05,39.19 43.07,39.17 47.58,39.17 49.68,37.07 50.19,37.07 v50.37,36.89
  Bottom 0.254: v57.05,30.82 57.05,14.34 57.18,14.21 57.18,14.16 57.2,14.13 J3.4 | v41.05,52.02 41.05,47.59 40.82,47.36 40.82,39.32 v40.95,39.19 | v50.37,36.89 50.55,36.71 50.55,35.12 50.73,34.94 50.73,33.18 53.08,30.82 v53.34,30.82
N$14  (via drill 0.3)
  Top 0.254: v44.56,41.98 44.58,41.98 44.58,40.86 U2.1 | v44.53,51.3 44.4,51.43 35.39,51.43 34.24,52.58 SW1.1
  Bottom 0.254: v44.56,41.98 44.53,42.01 v44.53,51.3
N$15  (via drill 0.3)
  Top 0.254: v22.57,20.76 23.03,20.76 23.28,20.5 24.79,20.5 C14.2 | X1.2 24.79,17.71 22.8,17.71 v22.72,17.64 22.72,17.82 19.8,17.82 v19.62,17.64 | v19.6,11.8 19.55,11.8 19.55,10.75 U6.7
  Bottom 0.254: v22.57,20.76 22.75,20.58 22.75,19.58 22.72,19.56 v22.72,17.64 | v19.6,11.8 19.62,11.83 v19.62,17.64
N$16  (via drill 0.3)
  Top 0.254: v62.99,20.43 63.17,20.25 64.19,20.25 64.37,20.07 U5.27 | v63.45,11.21 63.27,11.39 51.01,11.39 v50.83,11.21
  Bottom 0.254: v62.99,20.43 62.99,14.82 63.45,14.36 63.45,13.9 63.5,13.85 63.5,12.83 63.45,12.77 v63.45,11.21 | v50.83,11.21 49.88,10.27 49.88,9.65 J5.1
N$17  (via drill 0.3)
  Top 0.254: v77.33,19.76 77.07,19.76 76.35,20.48 71.69,20.48 70.82,21.35 70.13,21.35 U5.28 | v77.35,10.8 77.17,10.98 66.68,10.98 65.96,10.27 v52.85,10.27
  Bottom 0.254: v77.33,19.76 77.33,15.08 77.35,15.05 v77.35,10.8 | v52.85,10.27 52.83,10.24 51.88,10.24 51.88,9.65 J5.2
N$18
  Top 0.508: U1.3 42.54,39.73 43.28,39.73 43.3,39.71 47.17,39.71 47.91,40.45 47.91,42.11 45.74,42.11 45.51,42.34 45.51,43.21 U2.5
N$19
  Top 0.254: Q2.1 6.18,22.09 3.34,22.09 3.27,22.17 3.27,24.73 7.51,24.73 8.36,23.88 9.05,23.88 R11.1
N$20  (via drill 0.3)
  Top 0.254: C11.2 24.82,10.6 25.33,10.6 25.36,10.62 25.36,13.39 24.82,13.39 X1.1 24.69,13.39 21.47,13.39 20.83,14.03 20.55,14.03 v20.37,14.21 | v20.37,11.8 20.8,11.8 20.8,10.75 U6.8
  Bottom 0.254: v20.37,11.8 20.55,11.98 20.55,14.03 v20.37,14.21
N$21  (via drill 0.3)
  Top 0.254: v82.57,18.76 82.75,18.58 84.49,18.58 84.6,18.69 85.98,18.69 85.98,17.79 S3.12
  Bottom 0.254: v82.57,18.76 82.57,17.3 82.55,17.28 SJ6.1
N$22
  Top 0.254: U3.5 25.26,37.5 25.28,37.5 25.31,37.53 R3.2
N$23  (via drill 0.3)
  Top 0.508: Q4.1 6.18,13.46 5.67,13.46 3.98,11.78 3.98,10.62 R21.2 3.96,10.34 3.98,10.34 3.98,9.93 4.39,9.52 11.92,9.52 11.94,9.5 17.68,9.5 17.83,9.34 18.98,9.34 | 18.98,9.34 18.98,7.76 USB-C.VBUS1 | v23.11,8.93 23.9,8.93 USB-C.VBUS2 | v20.44,9.65 20.37,9.57 19.11,9.57 18.98,9.34 | v21.08,19.07 21.13,19.02 22.21,19.02 22.21,19.56 D3.A
  Bottom 0.508: v23.11,8.93 22.39,9.65 21.08,9.65 | v20.44,9.65 21.08,9.65 | 21.08,9.65 v21.08,19.07
N$24
  Top 0.254: R29.1 27.28,7.17 26.61,6.5 26.61,5.43 24.21,5.43 23.21,6.42 23.21,7.73 USB-C.B5
N$25  (via drill 0.3)
  Top 0.254: v86.67,7.91 85.8,8.78 S4.6
  Bottom 0.254: v86.67,7.91 86.67,9.01 SJ8.1
N$26  (via drill 0.3)
  Top 0.254: v83.57,6.81 84.55,6.81 84.55,7.32 84.75,7.52 85.26,7.52 S4.5
  Bottom 0.254: v83.57,6.81 83.57,6.42 83.62,6.37 83.62,5.73 SJ9.1
N$27  (via drill 0.3)
  Top 0.254: v85.08,25.37 85.26,25.19 86.98,25.19 86.98,23.17 86.8,22.99 86.13,22.99 S2.5
  Bottom 0.254: v85.08,25.37 85.08,26.44 SJ1.1
N$28  (via drill 0.3)
  Top 0.254: v22.57,23.65 22.39,23.47 20.42,23.47 20.37,23.52 13.61,23.52 13.25,23.88 12.25,23.88 R12.1 | v22.57,22.07 22.75,22.24 26.02,22.24 26.92,21.35 27.25,21.35 28.58,20.02 40.41,20.02 40.44,20.04 48.4,20.04 v48.58,20.22 | v48.58,16.74 53.19,16.74 53.31,16.87 53.31,18.87 54.75,18.87 55.11,18.51 63.55,18.51 v63.73,18.69 | v64.58,28.98 U5.34
  Bottom 0.254: v22.57,22.07 v22.57,23.65 | v48.58,20.22 48.4,20.04 48.4,16.92 v48.58,16.74 | v63.73,18.69 63.99,18.94 63.99,28.39 v64.58,28.98
N$29  (via drill 0.3)
  Top 0.254: v50.5,28.47 50.42,28.47 50.06,28.11 48.91,28.11 48.81,28 46.35,28 46.25,28.11 45.58,28.11 45.53,28.16 32.55,28.16 27.05,22.65 21.54,22.65 20.78,21.89 20.26,21.89 20.21,21.94 18.24,21.94 16.88,20.58 13.45,20.58 12.94,20.07 12.25,20.07 R14.1 | v53.34,29.64 53.52,29.82 v59.64,29.82 | v60.92,30.23 61.1,30.41 69.24,30.41 69.42,30.23 U5.35
  Bottom 0.254: v50.5,28.47 50.52,28.49 50.52,30.46 50.32,30.67 50.32,31.18 50.65,31.51 51.21,31.51 52.9,29.82 53.16,29.82 v53.34,29.64 | v59.64,29.82 60.51,29.82 v60.92,30.23
N$30
  Top 0.254: Q3.1 9.05,18.28 R13.1
N$31
  Top 0.254: R28.1 26.79,4.84 26.61,5.02 24.03,5.02 22.9,6.14 21.65,6.14 21.62,6.17 20.6,6.17 20.19,6.58 20.19,7.73 USB-C.A5
N$32
  Top 0.254: LED1.C 17.99,43.14 18.5,43.14 18.52,43.16 18.52,44.95 18.57,44.95 R2.2
N$33
  Top 0.254: LED2.C 17.22,41.32 18.45,41.32 20.49,43.37 20.49,46.21 21.11,46.21 R1.2
N$34  (via drill 0.3)
  Top 0.254: v7.41,23.58 7.11,23.88 Q2.2 | v7.41,20.4 7.75,20.07 9.05,20.07 R13.2 9.18,20.07 10.69,20.07 10.69,18.17 11.33,17.54 14.45,17.54 U6.14
  Bottom 0.254: v7.41,20.4 v7.41,23.58
N$35
  Top 0.254: LED4.C 15.66,37.71 15.35,37.71 15.35,35.33 R4.2
N$36  (via drill 0.3)
  Top 0.254: v18.09,39.42 18.01,39.5 16.45,39.5 LED3.C | v18.09,35.33 R5.2
  Bottom 0.254: v18.09,35.33 v18.09,39.42
N$37  (via drill 0.3)
  Top 0.254: v54.49,17.1 54.13,17.1 53.36,16.33 50.04,16.33 46.17,12.47 35.09,12.47 34.8,12.75 31.43,12.75 31.4,12.77 31.3,12.77 29.27,14.8 20.11,14.8 19.88,14.57 9.9,14.57 9.82,14.49 9.67,14.49 9.56,14.39 8.56,14.39 8.54,14.41 8.36,14.41 8.33,14.39 5.29,14.39 5.29,14.98 5.06,15.21 3.67,15.21 3.67,19.17 4.16,19.17 Q3.3 | v54.49,18.28 54.67,18.1 65.81,18.1 65.83,18.07 68.88,18.07 69.42,17.54 U5.25
  Bottom 0.254: v54.49,18.28 v54.49,17.1
N$38  (via drill 0.3)
  Top 0.254: v8,19.48 7.82,19.66 7.57,19.66 7.41,19.81 7.16,19.81 6.9,20.07 Q3.2 | v8,22.09 9.05,22.09 R11.2 | v11.28,19.02 15.73,19.02 U6.13
  Bottom 0.254: v8,22.09 v8,19.48 8.1,19.4 10.89,19.4 v11.28,19.02
N$39  (via drill 0.3)
  Top 0.254: R25.1 59.46,3.79 R24.2 56.31,3.79 55.72,3.79 54.98,3.04 49.65,3.04 49.32,3.38 v45.23,3.38 | v46.99,22.83 47.55,22.83 48.6,23.88 U5.9
  Bottom 0.254: v46.99,22.83 47.17,22.65 47.17,11.16 47.14,11.13 47.14,10.03 45.23,8.12 v45.23,3.38
N$40  (via drill 0.3)
  Top 0.254: R23.1 53.62,3.79 50.6,3.79 R22.2 50.47,3.79 48.75,3.79 v47.55,4.98 | v47.4,23.52 47.4,23.76 51.34,27.7 U5.6
  Bottom 0.254: v47.4,23.52 47.58,23.35 47.58,10.98 47.55,10.96 v47.55,4.98
N$41  (via drill 0.3)
  Top 0.254: v36.67,7.78 37.26,7.19 38.67,7.19 39.51,6.35 48.19,6.35 49.68,4.86 57.36,4.86 58.1,5.6 59.46,5.6 R25.2
  Bottom 0.254: v36.67,7.78 36.67,8.37 36.65,8.4 J6.2
N$42  (via drill 0.3)
  Top 0.254: v38.67,7.78 39.69,6.76 48.37,6.76 48.78,6.35 51.75,6.35 52.16,5.94 52.6,5.94 52.93,5.6 53.62,5.6 R23.2
  Bottom 0.254: v38.67,7.78 38.67,8.91 38.64,8.93 J6.3
N$43  (via drill 0.3)
  Top 0.254: R18.2 44.89,14.36 R17.1 44.89,18.28 44.89,18.79 44.92,18.81 v50.91,18.81 | v50.91,26.42 U5.7
  Bottom 0.254: v50.91,26.42 50.93,26.39 50.93,18.84 v50.91,18.81
N$44  (via drill 0.3)
  Top 0.254: v14.48,12.19 14.45,12.19 14.45,10.75 U6.3 | v14.48,18.28 12.25,18.28 R14.2
  Bottom 0.254: v14.48,12.19 14.3,12.36 14.3,18.1 v14.48,18.28
N$45  (via drill 0.3)
  Top 0.254: v13.86,11.7 13.2,11.7 13.2,10.75 U6.2 | v13.89,22.09 12.25,22.09 R12.2
  Bottom 0.254: v13.86,11.7 13.89,11.72 v13.89,22.09
N$46  (via drill 0.3)
  Top 0.254: v27.05,22.07 27.23,22.24 47.25,22.24 47.43,22.42 47.73,22.42 47.94,22.63 52.11,22.63 U5.10
  Bottom 0.254: v27.05,22.07 27.05,25.01 26.61,25.45 SJ2.2
N$47  (via drill 0.3)
  Top 0.254: v64.81,21.43 68.8,21.43 68.8,21.89 69.54,22.63 70.11,22.63 U5.29
  Bottom 0.254: v64.81,21.43 J3.7
N$49
  Top 0.254: LED5.A 13.81,31.13 14.61,31.13 15.12,31.64 19.21,31.64 19.21,31.13 R8.1
N$50  (via drill 0.3)
  Top 0.508: 39.69,32.77 35.62,32.77 D1.C | 39.69,32.77 40.49,32.77 40.49,31.87 U4.1 | v39.82,36.58 39.69,36.45 38.93,36.45 C3.2 | U1.1 40.62,40.86 40.62,40.22 40.59,40.19 v39.82,40.19 39.69,40.42 37.31,40.42 Q1.2 37.31,41.29 37.31,41.96 39.9,44.54 44.58,44.54 44.58,43.24 U2.6 | v39.69,33.38 39.69,32.77
  Bottom 0.508: v39.82,40.19 v39.82,36.58 39.69,36.35 v39.69,33.38
N$51
  Top 0.254: LED7.A 6.18,26.03 19.19,26.03 R10.1
N$52  (via drill 0.3)
  Top 0.254: v20.08,25.88 21.01,25.88 R10.2
  Bottom 0.254: v20.08,25.88 19.7,25.5 19.7,24.78 SJ4.1
N$53  (via drill 0.3)
  Top 0.254: LED5.C 12.3,31.13 12.81,31.13 13.04,31.36 13.04,31.87 14.76,31.87 14.94,32.05 25.26,32.05 25.26,31.87 U3.1 25.23,31.72 25.26,31.72 25.26,31.44 v24.51,31.44
  Bottom 0.254: v24.51,31.44 25.79,30.16 25.79,28.08 SJ2.1
N$54  (via drill 0.3)
  Top 0.254: v23.87,32.64 23.69,32.46 14.94,32.46 14.94,37.58 14.81,37.71 14.2,37.71 LED4.A | v24,19.79 24,19.61 40.59,19.61 40.62,19.63 49.73,19.63 50.09,19.99 50.6,19.99 51.5,19.1 51.5,18.81 U5.13
  Bottom 0.254: v23.87,32.64 23.87,30.51 23.82,30.46 23.82,19.97 v24,19.79
N$55
  Top 0.254: LED6.A 10,28.59 19.19,28.59 R9.1
N$56  (via drill 0.3)
  Top 0.254: 43.87,32.26 R7.2 | 43.87,32.26 42.41,32.26 42.41,31.87 U4.3 | v43.69,20.63 43.87,20.45 47.96,20.45 48.32,20.81 48.83,20.81 49.24,20.4 50.78,20.4 51.11,20.07 U5.12 | v43.87,32.15 43.87,32.26
  Bottom 0.254: v43.69,20.63 43.87,20.81 v43.87,32.15
N$58  (via drill 0.3)
  Top 0.254: v18.86,27.49 21.01,27.49 R9.2
  Bottom 0.254: v18.86,27.49 19.65,27.49 19.65,27.31 SJ3.1
N$64  (via drill 0.3)
  Top 0.254: v68.9,23.01 57.77,23.01 57.77,23.91 52.7,28.98 52.14,28.98 U5.5
  Bottom 0.254: v68.9,23.01 69.36,22.55 69.36,14.72 69.8,14.28 69.8,14.21 69.9,14.11 J3.9
N$65  (via drill 0.3)
  Top 0.254: v66.78,29.82 66.6,30 61.53,30 61.17,29.64 60.66,29.64 59.89,30.41 59.38,30.41 59.2,30.23 52.14,30.23 U5.4
  Bottom 0.254: v66.78,29.82 66.75,29.8 66.75,29.34 66.78,29.31 66.78,14.75 67.27,14.26 67.27,14.21 67.37,14.11 J3.8
N$72
  Top 0.254: U5.23 65.55,16.02 65.55,14.95 56.97,14.95 55.36,13.34 54.67,13.34 J3.3
N$73  (via drill 0.3)
  Top 0.254: v50.91,17.54 U5.14
  Bottom 0.254: v50.91,17.54 50.93,17.51 50.93,15.36 52.03,14.26 52.03,14.21 52.11,14.13 J3.2
N$74  (via drill 0.3)
  Top 0.254: v53.9,17.69 65.63,17.69 65.65,17.66 66.83,17.66 U5.24 | v53.9,15.36 53.52,15.36 53.49,15.33 50.32,15.33 49.99,15 49.99,13.34 49.6,13.34 J3.1
  Bottom 0.254: v53.9,15.36 v53.9,17.69
PC4/SDA  (via drill 0.3)
  Top 0.254: 79.02,9.45 75.99,9.45 75.28,10.16 v68.08,10.16 | 79.02,9.45 83.8,9.45 84.39,10.03 85.26,10.03 S4.7 | 81.99,18.17 80.88,18.17 80.24,17.54 | 81.99,18.17 85.16,18.17 85.16,17.79 S3.13 | 80.24,17.54 R20.1 | 76.92,30.33 76.81,30.33 75.99,29.52 75.12,29.52 74.92,29.31 73.97,29.31 72.36,27.7 | 76.92,30.33 77.71,30.33 S1.1 | 72.36,27.7 70.13,27.7 U5.33 | 83.98,25.96 83.98,27.01 83.14,27.01 82.96,26.83 73.2,26.83 72.44,27.6 72.36,27.7 | 83.98,25.96 83.98,25.62 84.83,24.78 86.57,24.78 86.57,23.63 86.13,23.63 S2.6 | v40.41,36.07 41.92,36.07 42.61,35.38 44.2,35.38 44.63,34.94 45.84,34.94 45.86,34.97 72.54,34.97 76.92,30.59 76.92,30.33 | 81.99,18.17 81.99,21.07 82.68,21.76 86.87,21.76 87.39,22.27 87.39,25.6 85.7,25.6 85.34,25.96 83.98,25.96 | v80.63,17.43 80.32,17.43 80.24,17.54 | v79.02,9.55 79.02,9.45
  Bottom 0.254: v68.08,10.16 68.06,10.19 67.11,10.19 67.11,9.65 J4.2 | v40.41,36.07 40.41,36.84 40.36,36.89 40.36,39.45 40.41,39.5 40.41,47.36 39.85,47.92 39.85,48.08 39.67,48.26 39.67,48.87 DISP.4 | v79.02,9.55 78.84,9.73 78.84,15.18 80.6,16.95 80.6,17.41 v80.63,17.43
PC5/SCL  (via drill 0.3)
  Top 0.254: 81.55,16.69 78.73,16.69 77.89,17.54 | 81.55,16.69 81.93,16.69 81.96,16.66 82.96,16.66 82.98,16.69 83.19,16.69 83.21,16.66 83.24,16.66 83.27,16.64 S3.14 | 77.89,17.54 77.27,17.54 R19.1 | v81.55,12.85 81.55,12.59 82.27,11.88 83.8,11.88 84.39,11.29 85.26,11.29 S4.8 | 81.55,16.69 v81.55,15.31 | v66.06,11.21 66.24,11.39 79.43,11.39 v79.53,11.49 | v81.99,29.85 81.5,30.33 80.45,30.33 S1.6 80.4,30.46 80.4,30.64 80.14,30.9 77.2,30.9 75.99,32.1 v75.99,32.36 | 82.39,23.09 83.21,23.09 83.32,22.99 84.55,22.99 S2.2 | 82.39,23.09 v81.99,23.09 | v75.15,31.51 70.13,31.51 U5.36 70,31.51 v68.9,31.51 | DISP.3 37.65,48.9 38.57,47.97 38.57,45.11 39.87,45.11 39.9,45.08 46.2,45.08 48.45,42.83 48.45,38.89 49.86,37.48 50.88,37.48 v50.96,37.4 | v53.34,34.38 53.52,34.56 68.72,34.56 v68.9,34.38 | 82.39,23.09 82.39,22.07 77.97,17.64 77.89,17.54
  Bottom 0.254: v81.55,15.31 v81.55,12.85 81.45,12.77 80.17,11.49 v79.53,11.49 | v66.06,11.21 65.11,10.27 65.11,9.65 J4.1 | v81.99,23.09 v81.99,29.85 | v75.99,32.36 v75.15,31.51 | v50.96,37.4 50.96,35.43 52.01,34.38 v53.34,34.38 | v68.9,34.38 68.93,34.35 68.93,31.54 v68.9,31.51
PD3/IRQ  (via drill 0.3)
  Top 0.254: U5.11 52.14,21.35 52.83,21.35 53.49,20.68 54,20.68 54.11,20.79 56.15,20.79 56.33,20.61 61.94,20.61 v62.12,20.43 62.12,20.61 62.53,21.02 63.25,21.02 63.6,20.66 64.37,20.66 64.55,20.48 68.6,20.48 v68.78,20.66 | v84.44,14.72 v68.78,14.72
  Bottom 0.254: SJ9.2 82.7,4.76 82.98,4.48 84.16,4.48 85.72,6.04 85.72,8.35 85.75,8.37 SJ8.2 85.75,9.14 85.75,9.68 85.72,9.7 85.72,10.01 85.7,10.03 SJ7.2 85.7,12.95 85.7,14.72 | 85.7,14.72 85.7,20.43 SJ5.2 85.7,20.56 85.7,21.09 85.65,21.14 85.65,21.48 84.83,22.3 84.83,23.09 84.19,23.73 84.19,26.44 SJ1.2 | v62.12,20.43 62.12,14.26 62.27,14.11 J3.6 | v68.78,20.66 68.95,20.48 68.95,14.9 v68.78,14.72 | 85.7,14.72 v84.44,14.72
SHLD
  pour Top: 16.17,8.32 26.72,8.32 26.72,0.06 16.17,0.06
  pour Bottom (isolate 0.254, rank 3): 16.05,8.26 16.05,0 26.84,0 26.84,8.26
USB_N
  Top 0.254: U6.6 18.27,11.03 17.83,11.47 17.83,12.57 18.46,13.21 20.49,13.21 22.27,11.43 22.27,9.53 22.17,9.42 21.06,9.42 20.79,9.15 20.79,9.07 20.69,8.98 USB-C.B7 20.69,6.66 20.77,6.58 21.61,6.58 21.69,6.66 USB-C.A7
USB_P
  Top 0.254: USB-C.A6 21.19,8.98 21.23,9.02 22.14,9.02 | 22.14,9.02 22.34,9.02 22.68,9.36 22.68,11.6 20.66,13.61 18.29,13.61 17.42,12.74 17.42,11.45 17,11.03 U6.5 | USB-C.B6 22.19,8.96 22.14,9.02
V_BATT  (via drill 0.3)
  Top 0.508: 31.12,11.8 C15.2 | 31.12,11.8 33.35,9.57 33.35,8.91 J1.+ | v32.19,14.31 R16.2 | v32.24,12.16 32.19,12.21 31.43,12.21 31.25,12.03 31.12,11.8 | v32.22,42.96 36.37,42.96 Q1.3 | v32.22,32.54 27.18,32.54 27.15,32.51 27.15,31.87 U3.3
  Bottom 0.508: v32.24,12.16 32.24,14.26 v32.19,14.31 32.24,14.54 32.24,16.95 32.19,17 32.19,32.31 v32.22,32.54 32.22,35.97 32.17,36.02 32.17,40.75 32.22,40.8 v32.22,42.96
V_USB  (via drill 0.3)
  Top 0.508: 23.36,19.07 37.42,19.07 38.21,18.28 D2.C | 23.36,19.07 23.31,19.02 23.31,18.35 18.45,18.35 17.91,18.89 D3.C | v34.11,40.5 34.16,40.45 35.42,40.45 Q1.1 | v34.24,37.07 D1.A | U3.4 27.15,34.92 C2.2 29.63,34.92 31.73,34.92 31.86,34.79 32.32,34.79 R6.2 32.58,34.79 32.94,34.79 | 23.28,30.72 27.82,30.72 28.97,31.87 31.86,31.87 31.91,31.82 32.53,31.82 32.94,32.23 32.94,34.79 | 23.28,30.72 21.01,30.72 21.01,31.1 R8.2 | v34.24,34.82 34.19,34.87 33.17,34.87 32.94,34.79 | v23.31,19.3 23.36,19.07 | v23.28,30.77 23.28,30.72
  Bottom 0.508: v34.11,40.5 34.11,38.96 34.29,38.78 34.29,37.12 v34.24,37.07 34.29,36.84 34.29,34.87 v34.24,34.82 | v23.31,19.3 23.28,19.33 v23.28,30.77

### Text on the board
tNames: ON/OFF | User | ESP32 | Sensors | GPIO2 | GPIO12 | GPIO15 | GPIO23 | GPIO4 | GPIO26 | GPIO5 | S_VP | S_VN | GND | 3V3 | + | - | + | - | Battery | Solar Pannel
bNames: Charge State | Sens_PWR_Led | TSL_INT | ESP32_PWR_Led | Analog | Serial | I2C | ADXL_INT1 | RX2 | TX2 | 3V3 | GND | SCL | SDA | 3V3 | GND | 3V3 | GPIO33 | GPIO34 | GND | ADXL_ADR | GPIOs | ADXL_INT2 | MPL_INT1 | MPL_INT2